# Altium project VENTUNOQ.PrjPcb (part 18 of 18)
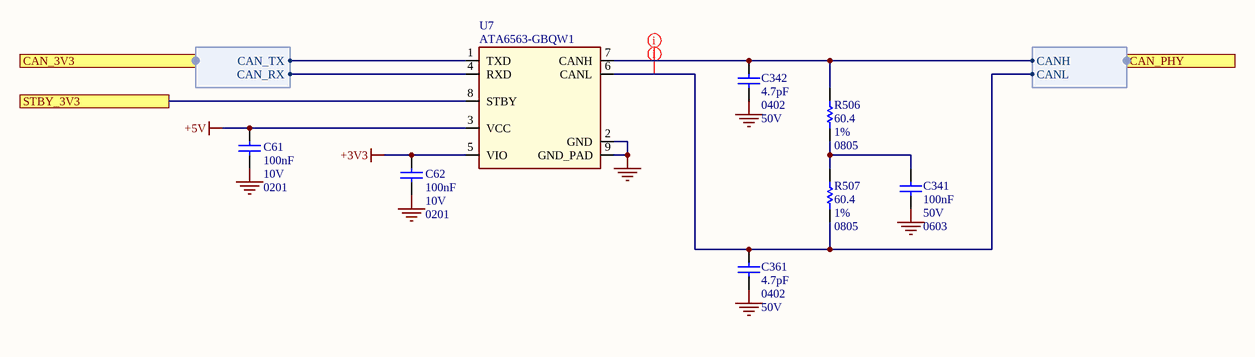
[diagram p53: CAN_PHY.SchDoc]

## Nets that join several sheets (continued)
USB1_CAP_SSTX_P: HEADERS_JOMEGA (D18.1 D18.10 JOMEGA.18), PCIE_USB (C113.2)
USB1_D_N: HEADERS_JOMEGA (D18.5 D18.6 JOMEGA.26), PCIE_USB (U24.B18)
USB1_D_P: HEADERS_JOMEGA (D18.4 D18.7 JOMEGA.24), PCIE_USB (U24.A20)
USB1_SSRX_N: HEADERS_JOMEGA (D19.2 D19.9 JOMEGA.32), PCIE_USB (U24.B16)
USB1_SSRX_P: HEADERS_JOMEGA (D19.1 D19.10 JOMEGA.30), PCIE_USB (U24.A18)
USB2_CAP_SSTX_N: USB_USBA (D79.5 D79.6 J7.17), PCIE_USB (C284.2)
USB2_CAP_SSTX_P: USB_USBA (D79.4 D79.7 J7.18), PCIE_USB (C283.2)
USB2_D_N: USB_USBA (D78.1 D78.10 J7.11), PCIE_USB (U24.A13)
USB2_D_P: USB_USBA (D78.2 D78.9 J7.12), PCIE_USB (U24.B12)
USB2_SSRX_N: USB_USBA (D78.5 D78.6 J7.14), PCIE_USB (U24.A10)
USB2_SSRX_P: USB_USBA (D78.4 D78.7 J7.15), PCIE_USB (U24.B9)
USB3_CAP_SSTX_N: HEADERS_JOMEGA (D19.5 D19.6 JOMEGA.38), PCIE_USB (C290.2)
USB3_CAP_SSTX_P: HEADERS_JOMEGA (D19.4 D19.7 JOMEGA.36), PCIE_USB (C289.2)
USB3_D_N: HEADERS_JOMEGA (D20.2 D20.9 JOMEGA.44), PCIE_USB (U24.A27)
USB3_D_P: HEADERS_JOMEGA (D20.1 D20.10 JOMEGA.42), PCIE_USB (U24.B25)
USB3_SSRX_N: HEADERS_JOMEGA (D20.5 D20.6 JOMEGA.50), PCIE_USB (U24.A29)
USB3_SSRX_P: HEADERS_JOMEGA (D20.4 D20.7 JOMEGA.48), PCIE_USB (U24.B27)
USB4_CAP_SSTX_N: USB_USBA (D77.2 D77.9 J7.8), PCIE_USB (C298.2)
USB4_CAP_SSTX_P: USB_USBA (D77.1 D77.10 J7.9), PCIE_USB (C297.2)
USB4_D_N: USB_USBA (D76.1 D76.10 J7.2), PCIE_USB (U24.A5)
USB4_D_P: USB_USBA (D76.2 D76.9 J7.3), PCIE_USB (U24.B5)
USB4_SSRX_N: USB_USBA (D76.5 D76.6 J7.5), PCIE_USB (U24.A7)
USB4_SSRX_P: USB_USBA (D76.4 D76.7 J7.6), PCIE_USB (U24.B6)
USBC_CC1: USB_USBC (D73.5 D73.6 J1.A5), USB_PD_CONTROLLER (C40.2 U5.40)
USBC_CC2: USB_USBC (D72.5 D72.6 J1.B5), USB_PD_CONTROLLER (C41.2 U5.39)
USBC_SBU1: USB_USBC (D72.4 D72.7 J1.A8), USB_PD_CONTROLLER (R88.2 U5.38)
USBC_SBU2: USB_USBC (D73.4 D73.7 J1.B8), USB_PD_CONTROLLER (R89.2 U5.37)
USBC_SSRX1_N: USB (C51.2 R437.1), USB_USBC (D74.1 D74.10 J1.B10)
USBC_SSRX1_P: USB (C50.2 R436.1), USB_USBC (D74.2 D74.9 J1.B11)
USBC_SSRX2_N: USB (C53.2 R450.1), USB_USBC (D75.1 D75.10 J1.A10)
USBC_SSRX2_P: USB (C52.2 R449.1), USB_USBC (D75.2 D75.9 J1.A11)
USBC_SSTX1_N: USB (R452.1), USB_USBC (D74.5 D74.6 J1.A3)
USBC_SSTX1_P: USB (R451.1), USB_USBC (D74.4 D74.7 J1.A2)
USBC_SSTX2_N: USB (R454.1), USB_USBC (D75.5 D75.6 J1.B3)
USBC_SSTX2_P: USB (R453.1), USB_USBC (D75.4 D75.7 J1.B2)
WAKE_N_3V3: PCIE (R327.2), U_PCIE/U_TRANSLATOR_4CH (U21_5.10)
XRES: USB_PD_CONTROLLER (C49.2 R90.2 TP37.X U5.24), U_USB/U_USB_PD_CONTROLLER/T8CH_ (U33_1.14)

## Assembly variants
Assembled_ABX00181: not fitted C70 C91 C97 C105 C121 C126 C256 C293 C302 C303 C304 C308 C314 C328 C329 C330 C333 C342 C345 C347 C348 C353 C361 R1 R3 R4 R5 R12 R13 R14 R15 R17 R21 R31 R32 R33 R34 R35 R36 R37 R39 R40 R41 R42 R43 R51 R57 R58 R60 R62 R63 R64 R68 R80 R81 R82 R83 R91 R92 R115 R119 R133 R138 R155 R158 R159 R160 R163 R164 R175 R176 R177 R188 R189 R192 R210 R211 R212 R213 R216 R217 R218 R221 R233 R234 R236 R244 R246 R247 R250 R251 R252 R253 R254 R255 R256 R257 R267 R275 R286 R287 R293 R295 R296 R297 R298 R304 R308 R310 R311 R316 R318 R322 R343 R344 R345 R347 R348 R353 R358 R400 R413 R420 R421 R426 R427 R438 R464 R465 R471 R475 R478 R479 R489 R493 R494 R497 R501 R504 R510 R511 U30